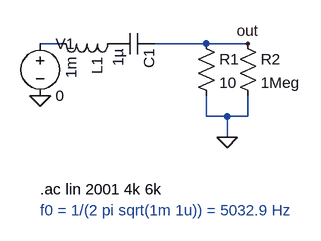
[diagram p0: schematic rlc_tjunction.asc]
rlc_tjunction.asc, the LTspice schematic file:
Version 4
SHEET 1 1600 1000
WIRE 0 16 32 16
WIRE 176 16 320 16
WIRE 256 96 256 128
WIRE 320 96 320 128
WIRE 256 128 320 128
WIRE 288 128 288 160
FLAG 0 96 0
FLAG 288 160 0
FLAG 320 16 out
SYMBOL voltage 0 0 R0
SYMATTR InstName V1
SYMATTR Value 0
SYMATTR Value2 AC 1
SYMBOL ind 128 0 R90
SYMATTR InstName L1
SYMATTR Value 1m
SYMBOL cap 176 0 R90
SYMATTR InstName C1
SYMATTR Value 1µ
SYMBOL res 240 0 R0
SYMATTR InstName R1
SYMATTR Value 10
SYMBOL res 304 0 R0
SYMATTR InstName R2
SYMATTR Value 1Meg
TEXT 0 240 Left 2 !.ac lin 2001 4k 6k
TEXT 0 272 Left 2 ;f0 = 1/(2 pi sqrt(1m 1u)) = 5032.9 Hz

The netlist it stands for:
* rlc_tjunction.asc
V1 N001 0 0 AC 1
L1 P001 N001 1m
C1 out P001 1µ
R1 out 0 10
R2 out 0 1Meg
.ac lin 2001 4k 6k
* f0 = 1/(2 pi sqrt(1m 1u)) = 5032.9 Hz
.backanno
.end